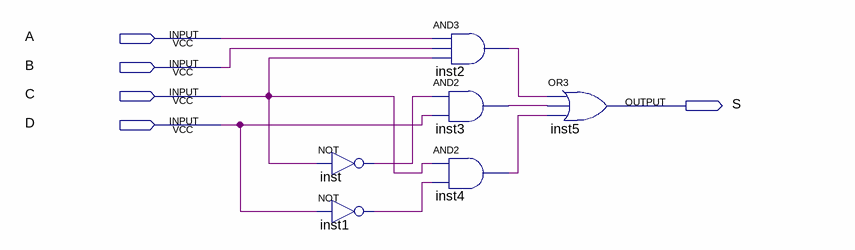
[diagram p0: schematic sheet]
// Quartus schematic misc_5.bdf as structural Verilog: 6 symbols, 5 pins
module misc_5 (
  input  A,
  input  B,
  input  C,
  input  D,
  output S
);

  wire inst1_out, inst2_out, inst3_out, inst4_out, inst_out;

  not inst (inst_out, C);
  not inst1 (inst1_out, D);
  and inst2 (inst2_out, A, B, C);
  and inst3 (inst3_out, inst_out, D);
  and inst4 (inst4_out, C, inst1_out);
  or inst5 (S, inst2_out, inst3_out, inst4_out);
endmodule
